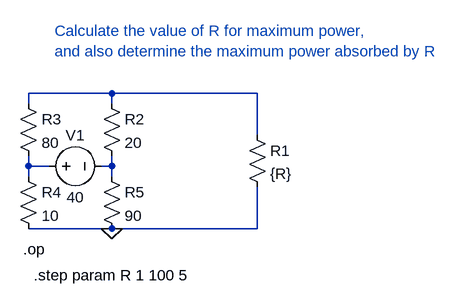
[diagram p0: schematic Lab3_ques3.asc]
Lab3_ques3.asc, the LTspice schematic file:
Version 4
SHEET 1 880 680
WIRE 16 160 -112 160
WIRE 240 160 16 160
WIRE -112 176 -112 160
WIRE 16 176 16 160
WIRE 240 224 240 160
WIRE -112 272 -112 256
WIRE -80 272 -112 272
WIRE 16 272 16 256
WIRE 16 272 0 272
WIRE -112 288 -112 272
WIRE 16 288 16 272
WIRE 16 368 -112 368
WIRE 240 368 240 304
WIRE 240 368 16 368
FLAG 16 368 0
SYMBOL Res 224 208 R0
SYMATTR InstName R1
SYMATTR Value {R}
SYMBOL Res 0 160 R0
SYMATTR InstName R2
SYMATTR Value 20
SYMBOL Res -128 160 R0
SYMATTR InstName R3
SYMATTR Value 80
SYMBOL Res -128 272 R0
SYMATTR InstName R4
SYMATTR Value 10
SYMBOL Res 0 272 R0
SYMATTR InstName R5
SYMATTR Value 90
SYMBOL Voltage -96 272 R270
WINDOW 0 32 56 VTop 2
WINDOW 3 -32 56 VBottom 2
SYMATTR InstName V1
SYMATTR Value 40
TEXT -72 64 Left 2 ;Calculate the value of R for maximum power,\nand also determine the maximum power absorbed by R
TEXT -120 400 Left 2 !.op
TEXT -104 440 Left 2 !.step param R 1 100 5

The netlist it stands for:
* Lab3_ques3.asc
R1 N001 0 {R}
R2 N001 N003 20
R3 N001 N002 80
R4 N002 0 10
R5 N003 0 90
V1 N002 N003 40
* Calculate the value of R for maximum power,
* and also determine the maximum power absorbed by R
.op
.step param R 1 100 5
.backanno
.end